# EAGLE design z80_SBC_micro (EAGLE 7.0.0)
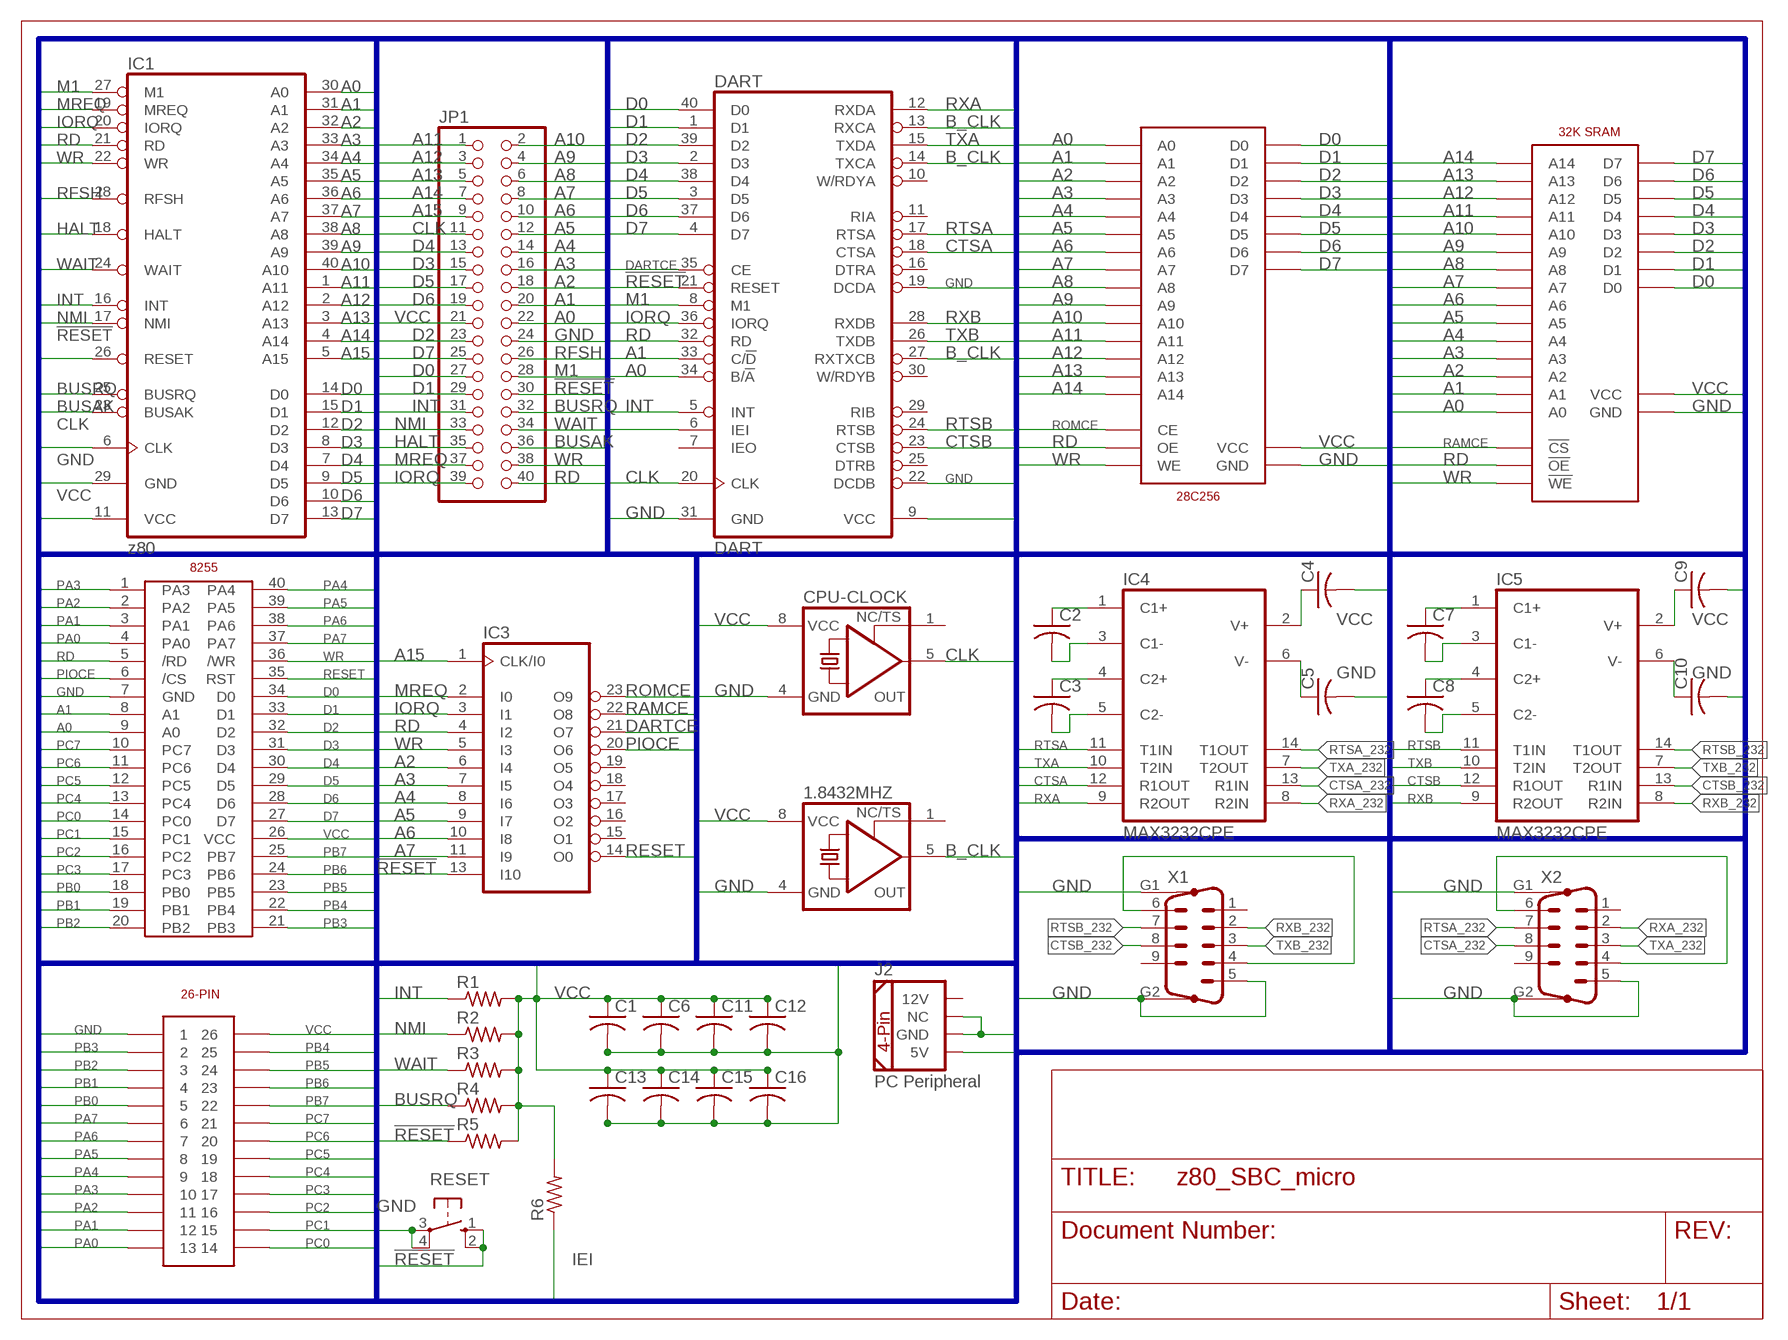
[diagram p0: schematic, sheet 1]

## Parts
1.8432MHZ  XO-8  [DIL08S]
28C256  28C256  [DIP28]
C1  C-USC0805  [C0805]
C2  C-USC0805  [C0805]
C3  C-USC0805  [C0805]
C4  C-USC0805  [C0805]
C5  C-USC0805  [C0805]
C6  C-USC0805  [C0805]
C7  C-USC0805  [C0805]
C8  C-USC0805  [C0805]
C9  C-USC0805  [C0805]
C10  C-USC0805  [C0805]
C11  C-USC0805  [C0805]
C12  C-USC0805  [C0805]
C13  C-USC0805  [C0805]
C14  C-USC0805  [C0805]
C15  C-USC0805  [C0805]
C16  C-USC0805  [C0805]
CPU-CLOCK  XO-8  [DIL08S]
DART  DART  Z80DART  [DIL40]
IC1  z80  Z80CPU  [DIL40]
IC3  22V10  [DIL24-3]
IC4  MAX3232CPE  [DIL16]
IC5  MAX3232CPE  [DIL16]
J1  SOCKET-DIP26  [SOCKET-DIP26]
J2  PC Peripheral  COMPUTER-PERIPHERAL-POWERVERTICAL  [COMPUTER-PERIPHERAL-POWER]
JP1  PINHD-2X20  [2X20]
R1  R-US_M0805  [M0805]
R2  R-US_M0805  [M0805]
R3  R-US_M0805  [M0805]
R4  R-US_M0805  [M0805]
R5  R-US_M0805  [M0805]
R6  R-US_M0805  [M0805]
RESET  10-XX  [B3F-10XX]
U1  32K SRAM  32K_SRAM_NARROW  [DIP28-300]
U$1  8255  [8255]
X1  M09HP  [M09HP]
X2  M09HP  [M09HP]

## Nets
!RESET: DART.21(RESET) IC1.26(RESET) IC3.13(I10) JP1.30 R5.1 RESET.1(S) RESET.2(S1)
A0: 28C256.P$10(A0) DART.34(B/!A) IC1.30(A0) JP1.22 U1.P$10(A0) U$1.9(A0)
A1: 28C256.P$9(A1) DART.33(C/!D) IC1.31(A1) JP1.20 U1.P$9(A1) U$1.8(A1)
A2: 28C256.P$8(A2) IC1.32(A2) IC3.6(I4) JP1.18 U1.P$8(A2)
A3: 28C256.P$7(A3) IC1.33(A3) IC3.7(I5) JP1.16 U1.P$7(A3)
A4: 28C256.P$6(A4) IC1.34(A4) IC3.8(I6) JP1.14 U1.P$6(A4)
A5: 28C256.P$5(A5) IC1.35(A5) IC3.9(I7) JP1.12 U1.P$5(A5)
A6: 28C256.P$4(A6) IC1.36(A6) IC3.10(I8) JP1.10 U1.P$4(A6)
A7: 28C256.P$3(A7) IC1.37(A7) IC3.11(I9) JP1.8 U1.P$3(A7)
A8: 28C256.P$25(A8) IC1.38(A8) JP1.6 U1.P$25(A8)
A9: 28C256.P$24(A9) IC1.39(A9) JP1.4 U1.P$24(A9)
A10: 28C256.P$21(A10) IC1.40(A10) JP1.2 U1.P$21(A10)
A11: 28C256.P$23(A11) IC1.1(A11) JP1.1 U1.P$23(A11)
A12: 28C256.P$2(A12) IC1.2(A12) JP1.3 U1.P$2(A12)
A13: 28C256.P$26(A13) IC1.3(A13) JP1.5 U1.P$26(A13)
A14: 28C256.P$1(A14) IC1.4(A14) JP1.7 U1.P$1(A14)
A15: IC1.5(A15) IC3.1(CLK/I0) JP1.9
B_CLK: 1.8432MHZ.5(OUT) DART.13(RXCA) DART.14(TXCA) DART.27(RXTXCB)
BUSAK: IC1.23(BUSAK) JP1.36
BUSRQ: IC1.25(BUSRQ) JP1.32 R4.1
CLK: CPU-CLOCK.5(OUT) DART.20(CLK) IC1.6(CLK) JP1.11
CTSA: DART.18(CTSA) IC4.12(R1OUT)
CTSA_232: IC4.13(R1IN) X2.8
CTSB: DART.23(CTSB) IC5.12(R1OUT)
CTSB_232: IC5.13(R1IN) X1.8
D0: 28C256.P$11(D0) DART.40(D0) IC1.14(D0) JP1.27 U1.P$11(D0) U$1.34(D0)
D1: 28C256.P$12(D1) DART.1(D1) IC1.15(D1) JP1.29 U1.P$12(D1) U$1.33(D1)
D2: 28C256.P$13(D2) DART.39(D2) IC1.12(D2) JP1.23 U1.P$13(D2) U$1.32(D2)
D3: 28C256.P$15(D3) DART.2(D3) IC1.8(D3) JP1.15 U1.P$15(D3) U$1.31(D3)
D4: 28C256.P$16(D4) DART.38(D4) IC1.7(D4) JP1.13 U1.P$16(D4) U$1.30(D4)
D5: 28C256.P$17(D5) DART.3(D5) IC1.9(D5) JP1.17 U1.P$17(D5) U$1.29(D5)
D6: 28C256.P$18(D6) DART.37(D6) IC1.10(D6) JP1.19 U1.P$18(D6) U$1.28(D6)
D7: 28C256.P$19(D7) DART.4(D7) IC1.13(D7) JP1.25 U1.P$19(D7) U$1.27(D7)
DARTCE: DART.35(CE) IC3.21(O7)
GND: 1.8432MHZ.4(GND) 28C256.P$14(GND) C1.2 C5.2 C6.2 C10.2 C11.2 C12.2 C13.2 C14.2 C15.2 C16.2 CPU-CLOCK.4(GND) DART.19(DCDA) DART.22(DCDB) DART.31(GND) IC1.29(GND) J1.P$1 J2.GND J2.NC JP1.24 RESET.3(P) RESET.4(P1) U1.P$14(GND) U$1.7(GND) X1.5 X1.G1 X1.G2 X2.5 X2.G1 X2.G2
HALT: IC1.18(HALT) JP1.35
IEI: DART.6(IEI) R6.1
INT: DART.5(INT) IC1.16(INT) JP1.31 R1.1
IORQ: DART.36(IORQ) IC1.20(IORQ) IC3.3(I1) JP1.39
M1: DART.8(M1) IC1.27(M1) JP1.28
MREQ: IC1.19(MREQ) IC3.2(I0) JP1.37
N$1: C7.1 IC5.1(C1+)
N$2: C8.1 IC5.4(C2+)
N$3: C8.2 IC5.5(C2-)
N$4: C7.2 IC5.3(C1-)
N$5: C9.1 IC5.2(V+)
N$6: C10.1 IC5.6(V-)
N$7: C2.1 IC4.1(C1+)
N$8: C3.1 IC4.4(C2+)
N$9: C2.2 IC4.3(C1-)
N$10: C3.2 IC4.5(C2-)
N$11: C4.1 IC4.2(V+)
N$12: C5.1 IC4.6(V-)
N$13: X1.4 X1.6
N$14: X2.4 X2.6
NMI: IC1.17(NMI) JP1.33 R2.1
PA0: J1.P$13 U$1.4(PA0)
PA1: J1.P$12 U$1.3(PA1)
PA2: J1.P$11 U$1.2(PA2)
PA3: J1.P$10 U$1.1(PA3)
PA4: J1.P$9 U$1.40(PA4)
PA5: J1.P$8 U$1.39(PA5)
PA6: J1.P$7 U$1.38(PA6)
PA7: J1.P$6 U$1.37(PA7)
PB0: J1.P$5 U$1.18(PB0)
PB1: J1.P$4 U$1.19(PB1)
PB2: J1.P$3 U$1.20(PB2)
PB3: J1.P$2 U$1.21(PB3)
PB4: J1.P$25 U$1.22(PB4)
PB5: J1.P$24 U$1.23(PB5)
PB6: J1.P$23 U$1.24(PB6)
PB7: J1.P$22 U$1.25(PB7)
PC0: J1.P$14 U$1.14(PC0)
PC1: J1.P$15 U$1.15(PC1)
PC2: J1.P$16 U$1.16(PC2)
PC3: J1.P$17 U$1.17(PC3)
PC4: J1.P$18 U$1.13(PC4)
PC5: J1.P$19 U$1.12(PC5)
PC6: J1.P$20 U$1.11(PC6)
PC7: J1.P$21 U$1.10(PC7)
PIOCE: IC3.20(O6) U$1.6(/CS)
RAMCE: IC3.22(O8) U1.P$20(!CS)
RD: 28C256.P$22(OE) DART.32(RD) IC1.21(RD) IC3.4(I2) JP1.40 U1.P$22(!OE) U$1.5(/RD)
RESET: IC3.14(O0) U$1.35(RST)
RFSH: IC1.28(RFSH) JP1.26
ROMCE: 28C256.P$20(CE) IC3.23(O9)
RTSA: DART.17(RTSA) IC4.11(T1IN)
RTSA_232: IC4.14(T1OUT) X2.7
RTSB: DART.24(RTSB) IC5.11(T1IN)
RTSB_232: IC5.14(T1OUT) X1.7
RXA: DART.12(RXDA) IC4.9(R2OUT)
RXA_232: IC4.8(R2IN) X2.2
RXB: DART.28(RXDB) IC5.9(R2OUT)
RXB_232: IC5.8(R2IN) X1.2
TXA: DART.15(TXDA) IC4.10(T2IN)
TXA_232: IC4.7(T2OUT) X2.3
TXB: DART.26(TXDB) IC5.10(T2IN)
TXB_232: IC5.7(T2OUT) X1.3
VCC: 1.8432MHZ.8(VCC) 28C256.P$28(VCC) C1.1 C4.2 C6.1 C9.2 C11.1 C12.1 C13.1 C14.1 C15.1 C16.1 CPU-CLOCK.8(VCC) DART.9(VCC) IC1.11(VCC) J1.P$26 J2.5V JP1.21 R1.2 R2.2 R3.2 R4.2 R5.2 R6.2 U1.P$28(VCC) U$1.26(VCC)
WAIT: IC1.24(WAIT) JP1.34 R3.1
WR: 28C256.P$27(WE) IC1.22(WR) IC3.5(I3) JP1.38 U1.P$27(!WE) U$1.36(/WR)
Unconnected: 1.8432MHZ.1(TS) CPU-CLOCK.1(TS) DART.7(IEO) DART.10(W/RDYA) DART.11(RIA) DART.16(DTRA) DART.25(DTRB) DART.29(RIB) DART.30(W/RDYB) IC3.15(O1) IC3.16(O2) IC3.17(O3) IC3.18(O4) IC3.19(O5) J2.12V X1.1 X1.9 X2.1 X2.9

## Buses
A[0..15],D[0..7],M1,MREQ,IORQ,RD,WR,RFSH,HALT,WAIT,INT,NMI,!RESET,RESET,BUSRQ,BUSAK,CLK,GND,VCC,RXA,TXA,RXB,TXB,RTSA,CTSA,RTSB,CTSB,B_CLK,PA[0..7],PB[0..7],PC[0..7],ROMCE,RAMCE,DARTCE,PIOCE,IEI

## Power pins joined to a net without a drawn wire
GND: IC3.12(GND) IC4.15(GND) IC5.15(GND)
VCC: IC3.24(VCC) IC4.16(VCC) IC5.16(VCC)

## Library data of the parts
1.8432MHZ CPU-CLOCK = crystal:XO-: CRYSTAL; OC_FARNELL: unknown; OC_NEWARK: unknown
28C256 = My_Parts:28C256
C1-C16 = resistor:C-US: CAPACITOR, American symbol
DART = zilog:Z80DART: Z80 FAMILY DEVICE
IC1 = zilog:Z80CPU: Z80 FAMILY DEVICE
IC3 = pal:22V10: PAL; MPN: GAL22V10D-7LPN; OC_FARNELL: 1571925; OC_NEWARK: 97M0480
IC4 IC5 = maxim:MAX3232*: True RS-232 Transceivers 3.0V to 5.5V, Low-Power up to 1Mbps, Using Four 0.1µF External Capacitors Source: http://pdfserv.maxim-ic.com/en/ds/MAX3222-MAX3241.pdf; MF: MAXIM; MPN: MAX3232CPE+; OC_FARNELL: 9724494; OC_NEWARK: 68K4626
J1 = My_Parts:SOCKET-DIP26
J2 = SparkFun-Connectors:COMPUTER-PERIPHERAL-POWER
JP1 = pinhead:PINHD-2X20: PIN HEADER
R1-R6 = resistor:R-US_: RESISTOR, American symbol
RESET = switch-omron:10-XX: OMRON SWITCH
U1 = My_Parts_old+:32K_SRAM_NARROW
U$1 = My_Parts_old+:8255
X1 X2 = con-subd:M09HP: SUB-D; OC_FARNELL: unknown; OC_NEWARK: unknown

## Board
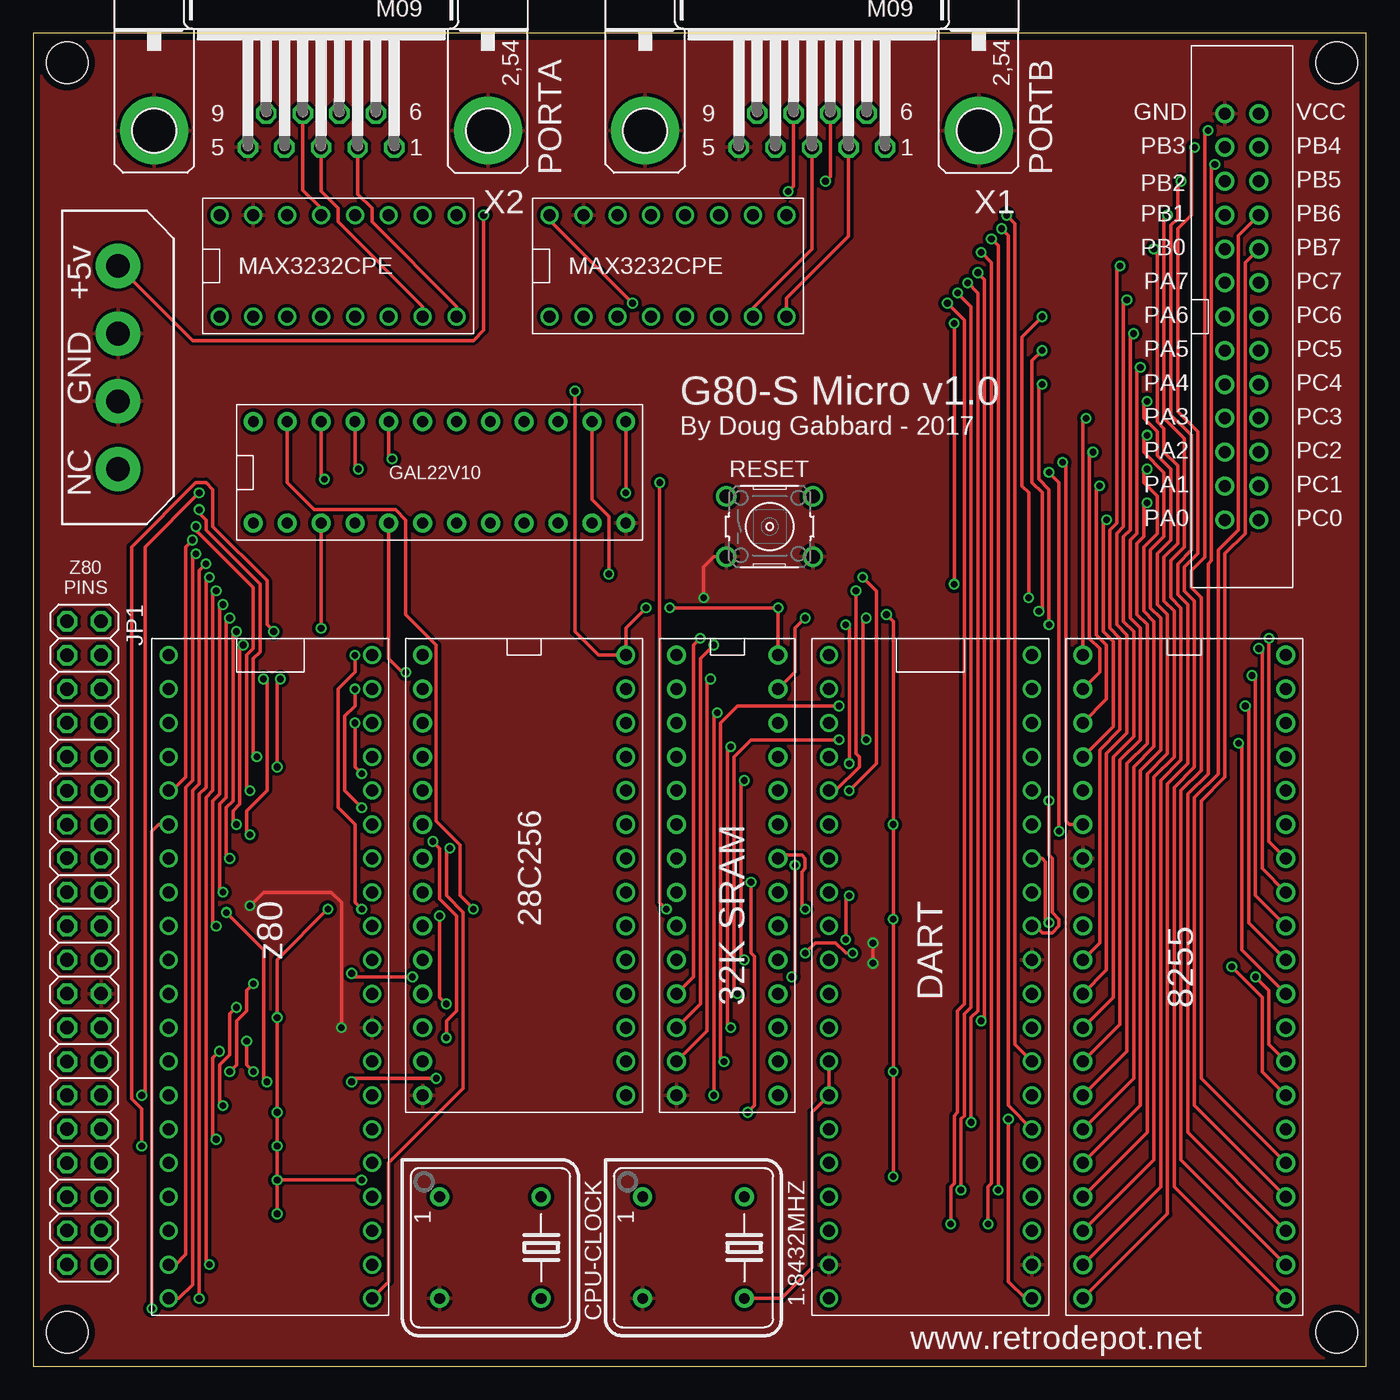
[diagram p1: board, top side]
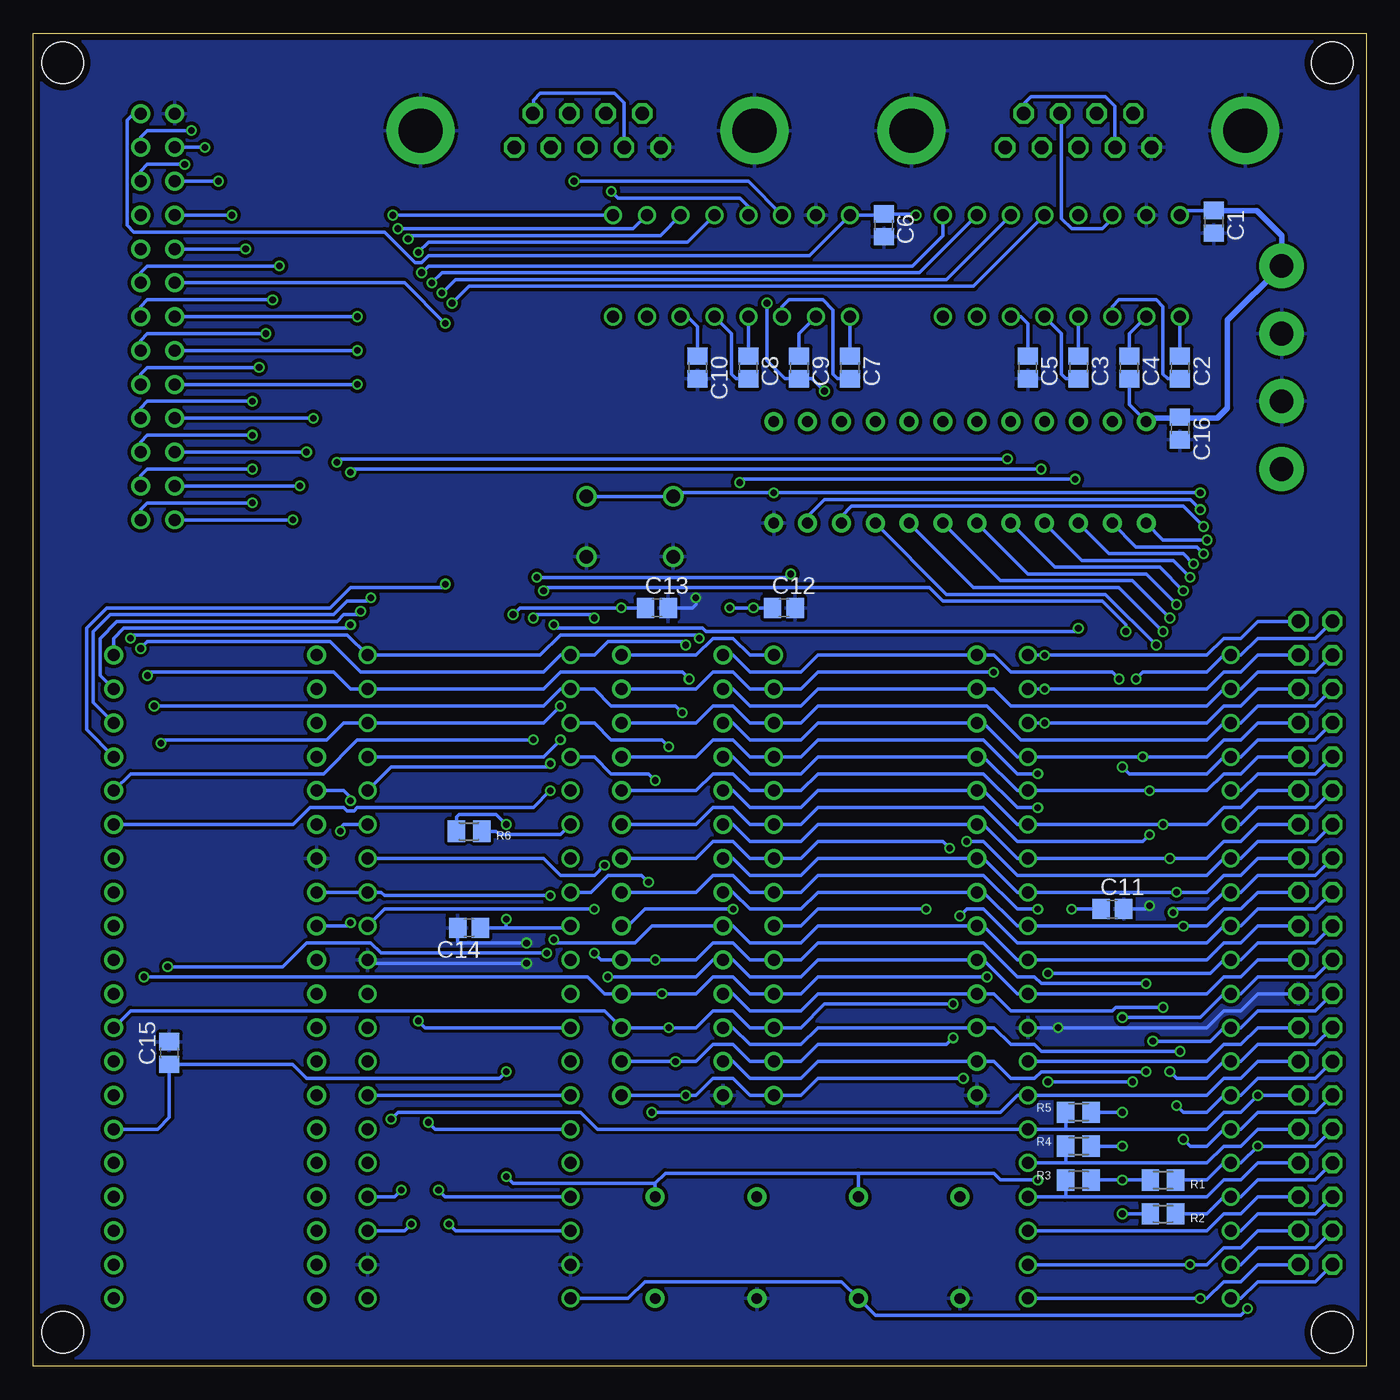
[diagram p2: board, bottom side, seen from below]

Size 100 x 100 mm. Coordinates in mm from the lower left corner, seen from the top.
Outline: 0,0 100,0 100,100 0,100 0,0
Copper layers (1*16): Top 0.035mm / dielectric 1.6mm / Bottom 0.035mm
Design rules "Elecrow_2-layer_PCB_eagle_rule": minimum track width 6mil, minimum drill 12mil, track to track 6mil, track to pad 6mil, pad to pad 6mil, via to via 8mil, smd to smd 0mil, copper to edge 20mil, drill to drill 10mil, minimum pad ring 6mil, minimum via ring 6mil, stop-mask expansion 0mil, vias tented up to drill 100mil, thermal gap 10mil
Holes 3.1 mm at 97.79,2.54 2.54,2.54 97.79,97.79 2.54,97.79

### Footprints (pad centres in the part's own frame; a part is rotated, then mirrored left to right if it is on the bottom)
DIL08S = drill 0.813 pad 1.422: 1 -3.81,-3.81; 4 3.81,-3.81; 5 3.81,3.81; 8 -3.81,3.81
DIP28 = drill 0.9 pad 1.422: P$1 -7.62,16.51; P$2 -7.62,13.97; P$3 -7.62,11.43; P$4 -7.62,8.89; P$5 -7.62,6.35; P$6 -7.62,3.81; P$7 -7.62,1.27; P$8 -7.62,-1.27; P$9 -7.62,-3.81; P$10 -7.62,-6.35; P$11 -7.62,-8.89; P$12 -7.62,-11.43; P$13 -7.62,-13.97; P$14 -7.62,-16.51; P$15 7.62,-16.51; P$16 7.62,-13.97; P$17 7.62,-11.43; P$18 7.62,-8.89; P$19 7.62,-6.35; P$20 7.62,-3.81; P$21 7.62,-1.27; P$22 7.62,1.27; P$23 7.62,3.81; P$24 7.62,6.35; P$25 7.62,8.89; P$26 7.62,11.43; P$27 7.62,13.97; P$28 7.62,16.51
C0805 = smd 1.3 x 1.5: 1 -0.85,0; 2 0.85,0
DIL40 = drill 0.9: 1 -24.13,-7.62; 2 -21.59,-7.62; 3 -19.05,-7.62; 4 -16.51,-7.62; 5 -13.97,-7.62; 6 -11.43,-7.62; 7 -8.89,-7.62; 8 -6.35,-7.62; 9 -3.81,-7.62; 10 -1.27,-7.62; 11 1.27,-7.62; 12 3.81,-7.62; 13 6.35,-7.62; 14 8.89,-7.62; 15 11.43,-7.62; 16 13.97,-7.62; 17 16.51,-7.62; 18 19.05,-7.62; 19 21.59,-7.62; 20 24.13,-7.62; 21 24.13,7.62; 22 21.59,7.62; 23 19.05,7.62; 24 16.51,7.62; 25 13.97,7.62; 26 11.43,7.62; 27 8.89,7.62; 28 6.35,7.62; 29 3.81,7.62; 30 1.27,7.62; 31 -1.27,7.62; 32 -3.81,7.62; 33 -6.35,7.62; 34 -8.89,7.62; 35 -11.43,7.62; 36 -13.97,7.62; 37 -16.51,7.62; 38 -19.05,7.62; 39 -21.59,7.62; 40 -24.13,7.62
DIL24-3 = drill 0.813 pad 1.422: 1 -13.97,-3.81; 2 -11.43,-3.81; 3 -8.89,-3.81; 4 -6.35,-3.81; 5 -3.81,-3.81; 6 -1.27,-3.81; 7 1.27,-3.81; 8 3.81,-3.81; 9 6.35,-3.81; 10 8.89,-3.81; 11 11.43,-3.81; 12 13.97,-3.81; 13 13.97,3.81; 14 11.43,3.81; 15 8.89,3.81; 16 6.35,3.81; 17 3.81,3.81; 18 1.27,3.81; 19 -1.27,3.81; 20 -3.81,3.81; 21 -6.35,3.81; 22 -8.89,3.81; 23 -11.43,3.81; 24 -13.97,3.81
DIL16 = drill 0.9: 1 -8.89,-3.81; 2 -6.35,-3.81; 3 -3.81,-3.81; 4 -1.27,-3.81; 5 1.27,-3.81; 6 3.81,-3.81; 7 6.35,-3.81; 8 8.89,-3.81; 9 8.89,3.81; 10 6.35,3.81; 11 3.81,3.81; 12 1.27,3.81; 13 -1.27,3.81; 14 -3.81,3.81; 15 -6.35,3.81; 16 -8.89,3.81
SOCKET-DIP26 = drill 0.9 pad 1.422: P$1 -1.27,15.24; P$2 -1.27,12.7; P$3 -1.27,10.16; P$4 -1.27,7.62; P$5 -1.27,5.08; P$6 -1.27,2.54; P$7 -1.27,0; P$8 -1.27,-2.54; P$9 -1.27,-5.08; P$10 -1.27,-7.62; P$11 -1.27,-10.16; P$12 -1.27,-12.7; P$13 -1.27,-15.24; P$14 1.27,-15.24; P$15 1.27,-12.7; P$16 1.27,-10.16; P$17 1.27,-7.62; P$18 1.27,-5.08; P$19 1.27,-2.54; P$20 1.27,0; P$21 1.27,2.54; P$22 1.27,5.08; P$23 1.27,7.62; P$24 1.27,10.16; P$25 1.27,12.7; P$26 1.27,15.24
COMPUTER-PERIPHERAL-POWER = drill 1.778 pad 3.302: 5V 7.62,0; 12V -7.62,0; GND 2.54,0; NC -2.54,0
2X20 = drill 1.016 octagon: 1 -24.13,-1.27; 2 -24.13,1.27; 3 -21.59,-1.27; 4 -21.59,1.27; 5 -19.05,-1.27; 6 -19.05,1.27; 7 -16.51,-1.27; 8 -16.51,1.27; 9 -13.97,-1.27; 10 -13.97,1.27; 11 -11.43,-1.27; 12 -11.43,1.27; 13 -8.89,-1.27; 14 -8.89,1.27; 15 -6.35,-1.27; 16 -6.35,1.27; 17 -3.81,-1.27; 18 -3.81,1.27; 19 -1.27,-1.27; 20 -1.27,1.27; 21 1.27,-1.27; 22 1.27,1.27; 23 3.81,-1.27; 24 3.81,1.27; 25 6.35,-1.27; 26 6.35,1.27; 27 8.89,-1.27; 28 8.89,1.27; 29 11.43,-1.27; 30 11.43,1.27; 31 13.97,-1.27; 32 13.97,1.27; 33 16.51,-1.27; 34 16.51,1.27; 35 19.05,-1.27; 36 19.05,1.27; 37 21.59,-1.27; 38 21.59,1.27; 39 24.13,-1.27; 40 24.13,1.27
M0805 = smd 1.3 x 1.6: 1 -0.95,0; 2 0.95,0
B3F-10XX = drill 1.016: 1 -3.251,2.261; 2 3.251,2.261; 3 -3.251,-2.261; 4 3.251,-2.261
DIP28-300 = drill 0.9 pad 1.422: P$1 -3.81,16.51; P$2 -3.81,13.97; P$3 -3.81,11.43; P$4 -3.81,8.89; P$5 -3.81,6.35; P$6 -3.81,3.81; P$7 -3.81,1.27; P$8 -3.81,-1.27; P$9 -3.81,-3.81; P$10 -3.81,-6.35; P$11 -3.81,-8.89; P$12 -3.81,-11.43; P$13 -3.81,-13.97; P$14 -3.81,-16.51; P$15 3.81,-16.51; P$16 3.81,-13.97; P$17 3.81,-11.43; P$18 3.81,-8.89; P$19 3.81,-6.35; P$20 3.81,-3.81; P$21 3.81,-1.27; P$22 3.81,1.27; P$23 3.81,3.81; P$24 3.81,6.35; P$25 3.81,8.89; P$26 3.81,11.43; P$27 3.81,13.97; P$28 3.81,16.51
8255 = drill 0.9 pad 1.422: 1 -7.62,22.86; 2 -7.62,20.32; 3 -7.62,17.78; 4 -7.62,15.24; 5 -7.62,12.7; 6 -7.62,10.16; 7 -7.62,7.62; 8 -7.62,5.08; 9 -7.62,2.54; 10 -7.62,0; 11 -7.62,-2.54; 12 -7.62,-5.08; 13 -7.62,-7.62; 14 -7.62,-10.16; 15 -7.62,-12.7; 16 -7.62,-15.24; 17 -7.62,-17.78; 18 -7.62,-20.32; 19 -7.62,-22.86; 20 -7.62,-25.4; 21 7.62,-25.4; 22 7.62,-22.86; 23 7.62,-20.32; 24 7.62,-17.78; 25 7.62,-15.24; 26 7.62,-12.7; 27 7.62,-10.16; 28 7.62,-7.62; 29 7.62,-5.08; 30 7.62,-2.54; 31 7.62,0; 32 7.62,2.54; 33 7.62,5.08; 34 7.62,7.62; 35 7.62,10.16; 36 7.62,12.7; 37 7.62,15.24; 38 7.62,17.78; 39 7.62,20.32; 40 7.62,22.86
M09HP = drill 1.016 octagon: 1 -5.486,1.27; 2 -2.743,1.27; 3 0,1.27; 4 2.743,1.27; 5 5.486,1.27; 6 -4.115,-1.27; 7 -1.372,-1.27; 8 1.372,-1.27; 9 4.115,-1.27 | drill 3.302 pad 5.08: G1 -12.522,0; G2 12.522,0

### Placement (x,y rotation side)
1.8432MHZ  49.53,8.89 270 top
28C256  36.83,36.83 0 top
C1  11.43,85.85 270 bottom
C2  13.97,74.93 270 bottom
C3  21.59,74.93 270 bottom
C4  17.78,74.93 270 bottom
C5  25.4,74.93 270 bottom
C6  36.2,85.6 270 bottom
C7  38.73,74.93 270 bottom
C8  46.35,74.93 270 bottom
C9  42.55,74.93 270 bottom
C10  50.16,74.93 270 bottom
C11  19.05,34.29 0 bottom
C12  43.69,56.9 0 bottom
C13  53.21,56.9 0 bottom
C14  67.31,32.89 180 bottom
C15  89.79,23.5 90 bottom
C16  13.97,70.36 270 bottom
CPU-CLOCK  34.29,8.89 270 top
DART  67.31,29.21 270 top
IC1  17.78,29.21 270 top
IC3  30.48,67.06 0 top
IC4  22.86,82.55 0 top
IC5  47.62,82.55 0 top
J1  90.68,78.74 0 top
J2  6.35,74.93 90 top
JP1  3.81,31.75 270 top
R1  15.24,13.97 180 bottom
R2  15.24,11.43 180 bottom
R3  21.59,13.97 0 bottom
R4  21.59,16.51 0 bottom
R5  21.59,19.05 0 bottom
R6  67.31,40.13 180 bottom
RESET  55.24,62.99 0 top
U1  52.07,36.83 0 top
U$1  86.36,30.48 0 top
X1  58.42,92.71 180 top
X2  21.59,92.71 180 top

### Tracks (layer width: path | path; a pad name or v marks a point on that pad's centre or on a via)
!RESET  (via drill 0.5)
  Top 0.254: v8.13,20.32 8.38,20.57 8.38,61.47 v12.45,65.53 | IC3.13 v44.45,65.53 | v73.15,18.54 73.15,6.35 74.42,5.08 DART.21
  Bottom 0.254: JP1.30 v8.13,20.32 9.4,19.05 10.67,19.05 11.94,17.78 22.61,17.78 | R5.1 22.54,17.85 22.61,17.78 | 22.61,17.78 IC1.26 57.66,17.78 58.93,19.05 72.64,19.05 v73.15,18.54 | v12.45,65.53 v44.45,65.53 51.71,65.53 RESET.1 RESET.2
A0  (via drill 0.5)
  Top 0.254: v57.15,37.59 57.15,29.46 v56.9,29.21 | DART.34 75.69,38.1 75.95,37.85 75.95,33.53 v76.2,33.27
  Bottom 0.254: JP1.22 8.13,30.48 9.4,29.21 10.67,29.21 11.94,27.94 IC1.30 26.16,27.94 28.7,30.48 28C256.P$10 41.15,30.48 42.42,29.21 46.23,29.21 47.5,30.48 U1.P$10 49.02,30.48 50.29,29.21 v56.9,29.21 | DART.34 61.72,38.1 60.45,36.83 57.91,36.83 v57.15,37.59 | v76.2,33.27 76.45,33.02 U$1.9
A1  (via drill 0.5)
  Top 0.254: v60.96,32 60.96,35.05 v61.21,35.31
  Bottom 0.254: JP1.20 8.13,33.02 9.4,31.75 10.67,31.75 11.94,30.48 IC1.31 26.16,30.48 28.7,33.02 28C256.P$9 41.15,33.02 42.42,31.75 46.23,31.75 47.5,33.02 U1.P$9 53.59,33.02 54.86,31.75 60.71,31.75 v60.96,32 | v61.21,35.31 73.66,35.31 73.91,35.56 DART.33 U$1.8
A2  (via drill 0.5)
  Top 0.254: v14.22,57.15 13.97,56.9 13.97,42.93 13.46,42.42 13.46,33.27 v13.72,33.02
  Bottom 0.254: JP1.18 8.13,35.56 9.4,34.29 10.67,34.29 11.94,33.02 13.46,33.02 v13.72,33.02 IC1.32 26.16,33.02 28.7,35.56 28C256.P$8 41.15,35.56 42.42,34.29 46.23,34.29 47.5,35.56 U1.P$8 | IC3.6 25.4,59.44 16.51,59.44 v14.22,57.15
A3  (via drill 0.5)
  Top 0.254: v14.73,56.13 14.48,55.88 14.48,42.67 13.97,42.16 13.97,35.81 v14.22,35.56
  Bottom 0.254: JP1.16 8.13,38.1 9.4,36.83 10.67,36.83 11.94,35.56 13.97,35.56 v14.22,35.56 IC1.33 26.16,35.56 28.7,38.1 28C256.P$7 41.15,38.1 42.42,36.83 46.23,36.83 47.5,38.1 U1.P$7 | IC3.7 27.43,58.93 17.53,58.93 v14.73,56.13
A4  (via drill 0.5)
  Top 0.254: v15.24,55.12 14.99,54.86 14.99,42.42 14.48,41.91 14.48,38.35 v14.73,38.1
  Bottom 0.254: JP1.14 8.13,40.64 9.4,39.37 10.67,39.37 11.94,38.1 14.48,38.1 v14.73,38.1 IC1.34 26.16,38.1 28.7,40.64 28C256.P$6 41.15,40.64 42.42,39.37 46.23,39.37 47.5,40.64 U1.P$6 | IC3.8 29.46,58.42 18.54,58.42 v15.24,55.12
A5  (via drill 0.5)
  Top 0.254: v15.75,54.1 15.49,53.85 15.49,42.16 14.99,41.66 14.99,40.89 v15.24,40.64
  Bottom 0.254: JP1.12 8.13,43.18 9.4,41.91 10.67,41.91 11.94,40.64 14.99,40.64 v15.24,40.64 IC1.35 26.16,40.64 28.7,43.18 28C256.P$5 41.15,43.18 42.42,41.91 46.23,41.91 47.5,43.18 U1.P$5 | IC3.9 31.5,57.91 19.56,57.91 v15.75,54.1
A6  (via drill 0.5)
  Top 0.254: v12.19,62.99 12.19,62.74 16.51,58.42 16.51,53.85 16,53.34 16,43.43 v16.26,43.18
  Bottom 0.254: JP1.10 8.13,45.72 9.4,44.45 10.67,44.45 11.94,43.18 16,43.18 v16.26,43.18 IC1.36 26.16,43.18 28.7,45.72 28C256.P$4 41.15,45.72 42.42,44.45 46.23,44.45 47.5,45.72 U1.P$4 | IC3.10 39.37,63.75 38.61,64.52 13.72,64.52 v12.19,62.99
A7  (via drill 0.5)
  Top 0.254: v12.45,64.26 12.45,64.01 12.95,63.5 12.95,62.74 17.02,58.67 17.02,53.59 16.51,53.09 16.51,45.97 v16.76,45.72
  Bottom 0.254: JP1.8 8.13,48.26 9.4,46.99 10.67,46.99 11.94,45.72 16.51,45.72 v16.76,45.72 IC1.37 26.16,45.72 28.7,48.26 28C256.P$3 41.15,48.26 42.42,46.99 46.23,46.99 47.5,48.26 U1.P$3 | IC3.11 41.91,63.75 40.64,65.02 13.21,65.02 v12.45,64.26
A8  (via drill 0.5)
  Top 0.254: v24.13,48.26 24.13,44.96 v24.64,44.45
  Bottom 0.254: JP1.6 8.13,50.8 9.4,49.53 10.67,49.53 11.94,48.26 v24.13,48.26 IC1.38 | U1.P$25 50.29,45.72 49.02,46.99 47.5,46.99 46.23,45.72 28C256.P$25 42.42,45.72 41.15,46.99 28.7,46.99 26.16,44.45 v24.64,44.45
A9  (via drill 0.5)
  Top 0.254: v24.13,50.8 24.13,49.53 23.37,48.77 23.37,43.18 v24.64,41.91
  Bottom 0.254: JP1.4 8.13,53.34 9.4,52.07 10.67,52.07 11.94,50.8 v24.13,50.8 IC1.39 | U1.P$24 50.29,43.18 49.02,44.45 47.5,44.45 46.23,43.18 28C256.P$24 42.42,43.18 41.15,44.45 28.7,44.45 26.16,41.91 v24.64,41.91
A10  (via drill 0.5)
  Top 0.254: v24.13,53.34 24.13,52.07 22.86,50.8 22.86,41.91 24.13,40.64 24.13,34.8 v24.64,34.29
  Bottom 0.254: JP1.2 8.13,55.88 9.4,54.61 10.67,54.61 11.94,53.34 v24.13,53.34 IC1.40 | U1.P$21 50.29,35.56 49.02,36.83 47.5,36.83 46.23,35.56 28C256.P$21 42.42,35.56 41.15,36.83 28.7,36.83 26.16,34.29 v24.64,34.29
A11  (via drill 0.5)
  Top 0.254: v17.27,51.56 17.53,51.31 17.53,43.18 16,41.66 16,40.13 v16.26,39.88
  Bottom 0.254: JP1.1 3.81,54.61 8.13,54.61 9.4,53.34 IC1.1 10.67,53.34 11.94,52.07 16.76,52.07 v17.27,51.56 | U1.P$23 50.29,40.64 49.02,41.91 47.5,41.91 46.23,40.64 28C256.P$23 42.42,40.64 41.15,41.91 28.7,41.91 26.16,39.37 16.76,39.37 v16.26,39.88
A12
  Bottom 0.254: JP1.3 3.81,52.07 8.13,52.07 9.4,50.8 IC1.2 10.67,50.8 11.94,49.53 26.67,49.53 27.94,50.8 28C256.P$2 41.15,50.8 42.42,49.53 46.23,49.53 47.5,50.8 U1.P$2
A13
  Bottom 0.254: JP1.5 3.81,49.53 8.13,49.53 9.4,48.26 IC1.3 10.67,48.26 11.94,46.99 25.91,46.99 28.45,49.53 41.15,49.53 42.42,48.26 28C256.P$26 46.23,48.26 47.5,49.53 49.02,49.53 50.29,48.26 U1.P$26
A14  (via drill 0.5)
  Top 0.254: v18.29,44.96 18.29,51.31 v18.54,51.56
  Bottom 0.254: JP1.7 3.81,46.99 8.13,46.99 9.4,45.72 IC1.4 10.67,45.72 11.94,44.45 17.78,44.45 v18.29,44.96 | U1.P$1 47.5,53.34 46.23,52.07 42.42,52.07 41.15,53.34 28C256.P$1 27.94,53.34 26.67,52.07 19.05,52.07 v18.54,51.56
A15  (via drill 0.5)
  Top 0.254: IC1.5 10.41,43.18 11.43,44.2 11.43,61.47 v11.94,61.98
  Bottom 0.254: JP1.9 3.81,44.45 8.13,44.45 9.4,43.18 IC1.5 | v11.94,61.98 15.24,61.98 IC3.1
B_CLK
  Top 0.254: DART.13 DART.14 58.42,19.05 58.42,7.37 56.13,5.08 1.8432MHZ.5
  Bottom 0.254: DART.27 DART.14
BUSAK
  Bottom 0.254: JP1.36 8.13,12.7 9.4,11.43 10.67,11.43 11.94,10.16 IC1.23
BUSRQ
  Bottom 0.254: JP1.32 8.13,17.78 9.4,16.51 10.67,16.51 11.94,15.24 22.61,15.24 | 22.61,15.24 IC1.25 | R4.1 22.54,15.31 22.61,15.24
CLK  (via drill 0.5)
  Top 0.254: v8.89,4.32 8.89,40.13 9.4,40.64 IC1.6
  Bottom 0.254: JP1.11 3.81,41.91 8.13,41.91 9.4,40.64 IC1.6 | v8.89,4.32 9.4,3.81 36.83,3.81 CPU-CLOCK.5 39.37,6.35 54.1,6.35 55.37,5.08 DART.20
CTSA  (via drill 0.5)
  Top 0.254: v68.83,10.67 68.83,13.46 69.09,13.72 69.09,18.8 69.34,19.05 69.34,26.67 69.85,27.18 69.85,78.49 v68.58,79.76
  Bottom 0.254: DART.18 68.33,10.16 v68.83,10.67 | v68.58,79.76 67.31,81.03 29.46,81.03 IC4.12
CTSA_232
  Top 0.254: X2.8 20.22,88.24 21.59,86.87 IC4.13
CTSB  (via drill 0.5)
  Top 0.254: v71.63,10.67 71.63,13.46 71.88,13.72 71.88,82.8 v71.12,83.57
  Bottom 0.254: DART.23 72.14,10.16 v71.63,10.67 | v71.12,83.57 70.36,84.33 50.93,84.33 IC5.12
CTSB_232  (via drill 0.5)
  Top 0.254: 56.9,88.39 v56.64,88.14 57.05,88.54 X1.8
  Bottom 0.254: IC5.13 46.35,87 46.99,87.63 56.13,87.63 v56.64,88.14
D0  (via drill 0.5)
  Top 0.254: v14.22,19.56 13.97,19.81 13.97,22.61 14.73,23.37 14.73,26.42 v15.24,26.92 | v50.04,54.61 49.53,54.1 49.53,29.21 U1.P$11 | v92.71,54.61 92.71,39.37 U$1.34
  Bottom 0.254: JP1.27 3.81,21.59 8.13,21.59 9.4,20.32 IC1.14 10.67,20.32 11.94,19.05 13.72,19.05 v14.22,19.56 | U1.P$11 47.5,27.94 46.23,26.67 42.42,26.67 41.15,27.94 28C256.P$11 27.94,27.94 26.67,26.67 19.05,26.67 18.8,26.92 v15.24,26.92 | v50.04,54.61 50.29,54.86 60.45,54.86 61.98,53.34 DART.40 76.45,54.86 92.46,54.86 v92.71,54.61
D1  (via drill 0.5)
  Top 0.254: v13.72,17.02 13.46,17.27 13.46,23.11 v13.97,23.62 | v51.05,54.1 50.04,53.09 50.04,27.18 U1.P$12 | U$1.33 92.2,37.34 92.2,53.59 v91.95,53.85
  Bottom 0.254: JP1.29 3.81,19.05 8.13,19.05 9.4,17.78 IC1.15 10.67,17.78 11.94,16.51 13.21,16.51 v13.72,17.02 | U1.P$12 47.5,25.4 46.23,24.13 42.42,24.13 41.15,25.4 28C256.P$12 27.94,25.4 26.67,24.13 24.89,24.13 24.38,23.62 v13.97,23.62 | v51.05,54.1 51.31,54.36 56.9,54.36 57.91,53.34 DART.1 60.45,53.34 61.72,52.07 75.44,52.07 77.72,54.36 91.44,54.36 v91.95,53.85
D2  (via drill 0.5)
  Top 0.254: v16,24.38 16,22.61 v16.51,22.1 | v50.8,51.56 50.55,51.31 50.55,25.15 U1.P$13 | v91.44,51.82 91.69,51.56 91.69,35.31 U$1.32
  Bottom 0.254: JP1.23 3.81,26.67 8.13,26.67 9.4,25.4 IC1.12 10.67,25.4 11.68,24.38 v16,24.38 | U1.P$13 47.5,22.86 46.23,21.59 42.42,21.59 41.15,22.86 28C256.P$13 27.94,22.86 26.67,21.59 24.89,21.59 24.38,22.1 v16.51,22.1 | v50.8,51.56 51.31,52.07 60.45,52.07 61.72,50.8 DART.39 76.2,50.8 77.47,52.07 91.19,52.07 v91.44,51.82
D3  (via drill 0.5)
  Top 0.254: v14.48,34.04 17.27,31.24 17.27,21.59 v17.53,21.34 | v23.88,21.34 24.13,21.59 v30.23,21.59 | v51.31,49.02 51.05,48.77 v51.05,20.32 | U$1.31 91.19,33.27 91.19,49.28 v90.93,49.53
  Bottom 0.254: JP1.15 3.81,36.83 8.13,36.83 9.4,35.56 IC1.8 10.67,35.56 11.94,34.29 14.22,34.29 v14.48,34.04 | U1.P$15 v51.05,20.32 50.29,20.32 49.02,21.59 47.5,21.59 46.23,20.32 28C256.P$15 42.42,20.32 41.15,21.59 v30.23,21.59 | v17.53,21.34 v23.88,21.34 | v51.31,49.02 51.82,49.53 56.64,49.53 57.91,50.8 DART.2 60.45,50.8 61.72,49.53 v90.93,49.53
D4  (via drill 0.5)
  Top 0.254: v30.99,24.64 30.99,25.91 31.75,26.67 31.75,33.78 30.48,35.05 30.48,38.86 v29.97,39.37 | v60.45,49.53 52.83,49.53 51.56,48.26 51.56,23.11 v51.82,22.86 | v90.42,46.74 90.68,46.48 90.68,31.24 U$1.30
  Bottom 0.254: JP1.13 3.81,39.37 8.13,39.37 9.4,38.1 IC1.7 10.67,38.1 11.94,36.83 26.16,36.83 28.7,39.37 v29.97,39.37 | U1.P$16 v51.82,22.86 50.29,22.86 49.02,24.13 47.5,24.13 46.23,22.86 28C256.P$16 42.42,22.86 41.15,24.13 31.5,24.13 v30.99,24.64 | v60.45,49.53 61.72,48.26 DART.38 76.71,48.26 77.98,46.99 90.17,46.99 v90.42,46.74
D5  (via drill 0.5)
  Top 0.254: v30.48,33.78 30.48,27.69 v30.99,27.18 | v52.32,46.48 52.07,46.23 52.07,25.65 v52.32,25.4
  Bottom 0.254: JP1.17 3.81,34.29 8.13,34.29 9.4,33.02 IC1.9 10.67,33.02 11.94,31.75 26.16,31.75 28.7,34.29 29.97,34.29 v30.48,33.78 | v30.99,27.18 40.64,27.18 42.42,25.4 28C256.P$17 46.23,25.4 47.5,26.67 49.02,26.67 50.29,25.4 v52.32,25.4 U1.P$17 57.15,26.67 92.71,26.67 U$1.29 | DART.3 57.91,48.26 56.64,46.99 52.83,46.99 v52.32,46.48
D6  (via drill 0.5)
  Top 0.254: v23.88,29.46 24.13,29.21 v28.45,29.21 | v60.45,46.99 53.85,46.99 52.58,45.72 52.58,28.19 v52.83,27.94 | U$1.28 92.71,24.13 92.71,28.19 v91.69,29.21
  Bottom 0.254: JP1.19 3.81,31.75 8.13,31.75 9.4,30.48 IC1.10 10.67,30.48 11.68,29.46 v23.88,29.46 | v28.45,29.21 41.15,29.21 42.42,27.94 28C256.P$18 46.23,27.94 47.5,29.21 49.02,29.21 50.29,27.94 v52.83,27.94 U1.P$18 57.15,27.94 58.42,29.21 v91.69,29.21 | DART.37 61.72,45.72 v60.45,46.99
D7  (via drill 0.5)
  Top 0.254: v14.73,22.1 15.24,22.61 15.24,25.91 16,26.67 16,28.19 v16.51,28.7 | v53.34,43.94 53.09,43.69 53.09,30.73 v53.34,30.48 | U$1.27 92.2,22.1 92.2,27.69 v89.92,29.97 | v61.47,30.99 60.96,30.99 60.2,31.75 58.67,31.75 v57.91,30.99
  Bottom 0.254: JP1.25 3.81,24.13 8.13,24.13 9.4,22.86 IC1.13 10.67,22.86 11.94,21.59 14.22,21.59 v14.73,22.1 | v16.51,28.7 24.38,28.7 24.89,29.21 26.16,29.21 28.7,31.75 41.15,31.75 42.42,30.48 28C256.P$19 46.23,30.48 47.5,31.75 49.02,31.75 50.29,30.48 v53.34,30.48 U1.P$19 57.4,30.48 v57.91,30.99 | DART.4 57.91,45.72 56.64,44.45 53.85,44.45 v53.34,43.94 | v89.92,29.97 81.28,29.97 79.5,31.75 74.68,31.75 73.91,30.99 v61.47,30.99
DARTCE  (via drill 0.5)
  Top 0.254: IC3.21 24.13,67.56 v24.38,67.31 | v76.2,67.06 76.96,66.29 v76.96,40.13
  Bottom 0.254: v24.38,67.31 75.95,67.31 v76.2,67.06 | v76.96,40.13 76.96,40.39 76.71,40.64 DART.35
GND  (via drill 0.5)
  Top 0.254: v62.99,31.75 v62.99,30.23 | v16.26,34.54 17.27,35.56 22.35,35.56 23.11,34.8 v23.11,25.4 | RESET.3 51.08,60.73 50.29,59.94 v50.29,57.66
  Bottom 0.254: JP1.24 8.13,27.94 9.4,26.67 10.67,26.67 11.94,25.4 v23.11,25.4 IC1.29 | C14.2 68.16,31.84 68.07,31.75 v62.99,31.75 | v62.99,30.23 74.68,30.23 DART.31 | C11.2 16.51,34.29 v16.26,34.54 | v50.29,57.66 50.29,57.15 50.55,56.9 C13.2
  pour Bottom (isolate 0.254): 0.25,99.82 99.82,99.82 99.82,0.25 0.25,0.25
  pour Top (isolate 0.254): 0.25,99.82 99.82,99.82 99.82,0.25 0.25,0.25
HALT
  Bottom 0.254: JP1.35 3.81,11.43 8.13,11.43 9.4,10.16 IC1.18
IEI
  Bottom 0.254: DART.6 60.45,39.88 65.02,39.88 65.28,40.13 R6.1
INT  (via drill 0.5)
  Top 0.254: v8.13,16.51 8.13,19.3 7.37,20.07 7.37,61.47 12.19,66.29 12.95,66.29 13.46,65.79 13.46,62.99 17.53,58.93 17.53,55.63 v18.03,55.12 | v61.72,58.17 61.72,45.97 61.98,45.72 61.98,44.96 60.2,43.18 DART.5
  Bottom 0.254: JP1.31 3.81,16.51 v8.13,16.51 9.4,15.24 IC1.16 10.67,15.24 11.94,13.97 R1.1 | v18.03,55.12 18.03,55.63 19.81,57.4 31.75,57.4 32.77,58.42 61.47,58.42 v61.72,58.17
IORQ  (via drill 0.5)
  Top 0.254: v12.95,60.2 12.45,59.69 12.45,43.69 11.94,43.18 11.94,6.1 10.92,5.08 IC1.20 | v61.21,45.21 61.21,55.37 v60.96,55.63 | v21.59,55.37 IC3.3
  Bottom 0.254: JP1.39 3.81,6.35 8.13,6.35 9.4,5.08 IC1.20 | IC3.3 19.3,60.96 13.72,60.96 v12.95,60.2 | DART.36 73.15,44.96 61.47,44.96 v61.21,45.21 | v60.96,55.63 60.71,55.37 49.78,55.37 49.53,55.12 21.84,55.12 v21.59,55.37
M1  (via drill 0.5)
  Top 0.254: v53.85,36.32 53.85,30.99 54.1,30.73 54.1,19.56 v53.59,19.05
  Bottom 0.254: JP1.28 8.13,22.86 9.4,21.59 10.67,21.59 11.94,20.32 IC1.27 26.16,20.32 27.43,19.05 v53.59,19.05 | DART.8 58.17,35.56 56.9,36.83 54.36,36.83 v53.85,36.32
MREQ  (via drill 0.5)
  Top 0.254: v12.19,60.96 11.94,60.71 11.94,43.94 11.43,43.43 11.43,8.38 10.67,7.62 IC1.19
  Bottom 0.254: JP1.37 3.81,8.89 8.13,8.89 9.4,7.62 IC1.19 | IC3.2 17.27,61.47 12.7,61.47 v12.19,60.96
N$1
  Bottom 0.254: C7.1 IC5.1
N$2
  Bottom 0.254: C8.1 IC5.4
N$3
  Bottom 0.254: C8.2 47.28,74.08 47.62,74.42 47.62,77.47 IC5.5
N$4
  Bottom 0.254: C7.2 39.66,74.08 40.01,74.42 40.01,79.25 40.77,80.01 43.31,80.01 43.81,79.5 IC5.3
N$5
  Bottom 0.254: IC5.2 42.55,77.47 C9.1
N$6
  Bottom 0.254: C10.1 50.16,77.98 50.93,78.74 IC5.6
N$7
  Bottom 0.254: C2.1 IC4.1
N$8
  Bottom 0.254: IC4.4 C3.1
N$9
  Bottom 0.254: C2.2 14.9,74.08 15.24,74.42 15.24,79.5 15.75,80.01 18.54,80.01 19.05,79.5 IC4.3
N$10
  Bottom 0.254: C3.2 22.52,74.08 22.86,74.42 22.86,77.47 IC4.5
N$11
  Bottom 0.254: IC4.2 17.78,77.47 C4.1
N$12
  Bottom 0.254: C5.1 25.4,78.23 25.91,78.74 IC4.6
N$13
  Bottom 0.254: X1.4 55.68,94.79 56.39,95.5 61.98,95.5 62.48,95 62.48,94.03 X1.6
N$14
  Bottom 0.254: X2.4 18.85,94.54 19.56,95.25 25.15,95.25 25.7,94.69 X2.6
NMI
  Bottom 0.254: JP1.33 3.81,13.97 8.13,13.97 9.4,12.7 IC1.17 10.67,12.7 11.94,11.43 R2.1
PA0  (via drill 0.5)
  Top 0.254: U$1.4 81.03,48.01 81.03,54.36 80.26,55.12 80.26,63.25 v80.52,63.5
  Bottom 0.254: v80.52,63.5 J1.P$13
PA1  (via drill 0.5)
  Top 0.254: U$1.3 80.52,50.04 80.52,54.1 79.76,54.86 79.76,65.79 v80.01,66.04
  Bottom 0.254: v80.01,66.04 J1.P$12
PA2  (via drill 0.5)
  Top 0.254: U$1.2 80.01,52.07 80.01,53.85 79.25,54.61 79.25,68.33 v79.5,68.58
  Bottom 0.254: v79.5,68.58 J1.P$11
PA3  (via drill 0.5)
  Top 0.254: U$1.1 78.74,70.87 v78.99,71.12
  Bottom 0.254: v78.99,71.12 J1.P$10
PA4  (via drill 0.5)
  Top 0.254: v76.2,55.63 76.2,65.79 75.44,66.55 75.44,73.41 v75.69,73.66
  Bottom 0.254: U$1.40 93.98,54.61 93.22,55.37 76.45,55.37 v76.2,55.63 | v75.69,73.66 J1.P$9
PA5  (via drill 0.5)
  Top 0.254: v75.44,56.64 75.69,56.9 75.69,65.53 74.93,66.29 74.93,75.44 v75.69,76.2
  Bottom 0.254: U$1.39 95,51.82 95,54.61 93.73,55.88 77.22,55.88 76.71,56.39 75.69,56.39 v75.44,56.64 | v75.69,76.2 J1.P$8
PA6  (via drill 0.5)
  Top 0.254: v74.68,57.66 74.68,65.53 74.17,66.04 74.17,77.22 v75.69,78.74
  Bottom 0.254: U$1.38 95.5,49.78 95.5,55.12 94.23,56.39 77.47,56.39 76.45,57.4 74.93,57.4 v74.68,57.66 | v75.69,78.74 J1.P$7
PA7  (via drill 0.5)
  Top 0.254: v69.09,58.67 v69.09,78.23
  Bottom 0.254: U$1.37 96.01,47.75 96.01,55.37 94.49,56.9 77.72,56.9 76.2,58.42 69.34,58.42 v69.09,58.67 | v69.09,78.23 72.14,81.28 J1.P$6
PB0  (via drill 0.5)
  Top 0.254: U$1.18 84.07,15.49 84.07,44.2 85.6,45.72 85.6,56.64 84.84,57.4 84.84,60.71 85.85,61.72 85.85,67.56 84.84,68.58 84.84,70.36 84.33,70.87 84.33,83.57 v84.07,83.82
  Bottom 0.254: v84.07,83.82 J1.P$5
PB1  (via drill 0.5)
  Top 0.254: U$1.19 84.58,13.46 84.58,43.94 86.11,45.47 86.11,56.9 85.34,57.66 85.34,60.45 86.36,61.47 86.36,69.6 84.84,71.12 84.84,86.11 v85.09,86.36
  Bottom 0.254: v85.09,86.36 J1.P$4
PB2  (via drill 0.5)
  Top 0.254: U$1.20 85.09,11.43 85.09,43.69 86.61,45.21 86.61,57.15 85.85,57.91 85.85,60.2 86.87,61.21 86.87,69.85 85.34,71.37 85.34,85.6 85.85,86.11 85.85,88.65 v86.11,88.9
  Bottom 0.254: v86.11,88.9 J1.P$3
PB3  (via drill 0.5)
  Top 0.254: U$1.21 85.6,13.46 85.6,43.43 87.12,44.96 87.12,57.4 86.36,58.17 86.36,59.94 87.38,60.96 87.38,70.1 85.85,71.63 85.85,85.34 86.87,86.36 86.87,91.19 v87.12,91.44
  Bottom 0.254: v87.12,91.44 J1.P$2
PB4  (via drill 0.5)
  Top 0.254: U$1.22 86.11,15.49 86.11,43.18 87.63,44.7 87.63,57.66 86.87,58.42 86.87,59.69 87.88,60.71 87.88,92.46 v88.14,92.71
  Bottom 0.254: v88.14,92.71 91.44,92.71 91.95,92.2 J1.P$25
PB5  (via drill 0.5)
  Top 0.254: U$1.23 86.61,17.53 86.61,42.93 88.14,44.45 88.14,60.2 88.39,60.45 88.39,89.92 v88.65,90.17
  Bottom 0.254: v88.65,90.17 91.44,90.17 91.95,89.66 J1.P$24
PB6
  Top 0.254: U$1.24 87.12,19.56 87.12,42.67 88.9,44.45 88.9,61.21 90.42,62.74 90.42,84.84 J1.P$23
PB7
  Top 0.254: U$1.25 87.63,21.59 87.63,42.42 89.41,44.2 89.41,60.96 90.93,62.48 90.93,82.8 J1.P$22
PC0  (via drill 0.5)
  Top 0.254: U$1.14 82.04,23.62 82.04,45.21 83.57,46.74 83.57,55.63 82.8,56.39 82.8,61.72 83.31,62.23 83.31,64.52 v83.57,64.77
  Bottom 0.254: v83.57,64.77 91.44,64.77 91.95,64.26 J1.P$14
PC1  (via drill 0.5)
  Top 0.254: U$1.15 82.55,21.59 82.55,44.96 84.07,46.48 84.07,55.88 83.31,56.64 83.31,61.47 84.33,62.48 84.33,65.28 83.31,66.29 83.31,67.06 v83.57,67.31
  Bottom 0.254: v83.57,67.31 91.44,67.31 91.95,66.8 J1.P$15
PC2  (via drill 0.5)
  Top 0.254: U$1.16 83.06,19.56 83.06,44.7 84.58,46.23 84.58,56.13 83.82,56.9 83.82,61.21 84.84,62.23 84.84,67.06 83.31,68.58 83.31,69.6 v83.57,69.85
  Bottom 0.254: v83.57,69.85 91.44,69.85 91.95,69.34 J1.P$16
PC3  (via drill 0.5)
  Top 0.254: U$1.17 83.57,17.53 83.57,44.45 85.09,45.97 85.09,56.39 84.33,57.15 84.33,60.96 85.34,61.98 85.34,67.31 84.33,68.33 84.33,70.1 83.31,71.12 83.31,72.14 v83.57,72.39
  Bottom 0.254: v83.57,72.39 91.44,72.39 91.95,71.88 J1.P$17
PC4  (via drill 0.5)
  Top 0.254: U$1.13 81.53,25.65 81.53,45.47 83.06,46.99 83.06,55.37 82.3,56.13 82.3,61.98 82.8,62.48 82.8,74.68 v83.06,74.93
  Bottom 0.254: v83.06,74.93 91.44,74.93 91.95,74.42 J1.P$18
PC5  (via drill 0.5)
  Top 0.254: U$1.12 81.03,27.69 81.03,45.72 82.55,47.24 82.55,55.12 81.79,55.88 81.79,62.23 82.3,62.74 82.3,77.22 v82.55,77.47
  Bottom 0.254: v82.55,77.47 91.44,77.47 91.95,76.96 J1.P$19
PC6  (via drill 0.5)
  Top 0.254: U$1.11 80.52,29.72 80.52,45.97 82.04,47.5 82.04,54.86 81.28,55.63 81.28,62.48 81.79,62.99 81.79,79.76 v82.04,80.01
  Bottom 0.254: v82.04,80.01 91.44,80.01 91.95,79.5 J1.P$20
PC7  (via drill 0.5)
  Top 0.254: U$1.10 80.01,31.75 80.01,46.23 81.53,47.75 81.53,54.61 80.77,55.37 80.77,62.74 81.28,63.25 81.28,82.3 v81.53,82.55
  Bottom 0.254: v81.53,82.55 91.44,82.55 91.95,82.04 J1.P$21
PIOCE  (via drill 0.5)
  Top 0.254: IC3.20 26.67,68.33 v26.92,68.07 | U$1.6 77.72,40.64 77.47,40.89 77.47,67.56 v77.22,67.82
  Bottom 0.254: v26.92,68.07 76.96,68.07 v77.22,67.82
RAMCE  (via drill 0.5)
  Top 0.254: IC3.22 21.59,66.8 v21.84,66.55 | v46.99,66.29 46.99,34.8 v47.5,34.29
  Bottom 0.254: v21.84,66.55 46.74,66.55 v46.99,66.29 | v47.5,34.29 54.1,34.29 55.37,33.02 U1.P$20
RD  (via drill 0.5)
  Top 0.254: v13.21,59.18 12.95,58.93 12.95,43.43 12.45,42.93 v12.45,5.08 | v31.24,38.86 30.99,38.61 30.99,35.31 32.26,34.04 32.26,20.83 26.67,15.24 26.67,6.35 IC1.21 | U1.P$22 56.13,38.35 57.66,38.35 57.91,38.1 57.91,37.34 57.66,37.08 57.66,34.54 v57.91,34.29 | DART.32 75.18,33.02 75.69,32.51 76.45,32.51 76.96,33.02 76.96,33.53 76.45,34.04 76.45,38.1 76.2,38.35 v76.2,42.42
  Bottom 0.254: JP1.40 8.13,7.62 9.4,6.35 10.67,6.35 11.94,5.08 v12.45,5.08 IC1.21 | U1.P$22 50.29,38.1 49.02,39.37 47.5,39.37 46.23,38.1 28C256.P$22 42.42,38.1 41.15,39.37 31.75,39.37 v31.24,38.86 | IC3.4 21.34,60.45 14.48,60.45 v13.21,59.18 | v57.91,34.29 73.66,34.29 DART.32 | v76.2,42.42 76.2,42.67 76.71,43.18 U$1.5
RESET  (via drill 0.5)
  Top 0.254: v61.21,43.18 63.25,45.21 63.25,58.17 v62.23,59.18 | v43.18,59.44 43.18,63.75 41.91,65.02 IC3.14
  Bottom 0.254: U$1.35 80.52,40.64 79.25,41.91 76.71,41.91 76.45,41.66 75.95,41.66 75.69,41.91 62.48,41.91 v61.21,43.18 | v62.23,59.18 43.43,59.18 v43.18,59.44
RFSH
  Bottom 0.254: JP1.26 8.13,25.4 9.4,24.13 10.67,24.13 11.94,22.86 IC1.28
ROMCE  (via drill 0.5)
  Top 0.254: IC3.23 19.05,66.29 21.08,64.26 27.18,64.26 27.94,63.5 27.94,56.39 30.23,54.1 30.23,40.89 32,39.12 32,35.31 v33.02,34.29
  Bottom 0.254: v33.02,34.29 41.15,34.29 42.42,33.02 28C256.P$20
RTSA  (via drill 0.5)
  Top 0.254: v69.6,13.21 69.6,18.54 69.85,18.8 69.85,26.42 70.36,26.92 70.36,79.5 v69.34,80.52
  Bottom 0.254: DART.17 69.09,12.7 v69.6,13.21 | v69.34,80.52 68.33,81.53 31.5,81.53 IC4.11
RTSA_232
  Bottom 0.254: IC4.14 19.05,86.11 19.81,85.34 22.1,85.34 22.86,86.11 22.86,93.88 X2.7
RTSB  (via drill 0.5)
  Top 0.254: v72.39,13.21 72.39,84.07 v71.88,84.58
  Bottom 0.254: DART.24 72.9,12.7 v72.39,13.21 | v71.88,84.58 71.63,84.84 52.96,84.84 IC5.11
RTSB_232  (via drill 0.5)
  Top 0.254: X1.7 59.79,89.26 v59.44,88.9
  Bottom 0.254: v59.44,88.9 46.35,88.9 IC5.14
RXA  (via drill 0.5)
  Top 0.254: v71.12,25.91 71.37,26.16 71.37,81.53 v70.87,82.04
  Bottom 0.254: DART.12 70.61,25.4 v71.12,25.91 | v70.87,82.04 70.36,82.55 34.04,82.55 31.75,84.84 IC4.9
RXA_232
  Top 0.254: IC4.8 31.75,79.5 25.4,85.85 25.4,86.87 24.33,87.94 X2.2
RXB  (via drill 0.5)
  Top 0.254: DART.28 73.66,24.13 73.66,85.72 v73.03,86.36
  Bottom 0.254: v73.03,86.36 IC5.9
RXB_232
  Top 0.254: X1.2 61.16,84.78 56.52,80.14 IC5.8
TXA  (via drill 0.5)
  Top 0.254: v70.36,18.29 70.36,26.16 70.87,26.67 70.87,80.52 v70.1,81.28
  Bottom 0.254: DART.15 69.85,17.78 v70.36,18.29 | v70.1,81.28 69.34,82.04 33.53,82.04 IC4.10
TXA_232
  Top 0.254: IC4.7 29.21,79.5 22.86,85.85 22.86,86.87 21.59,88.14 X2.3
TXB  (via drill 0.5)
  Top 0.254: DART.26 73.15,19.56 73.15,84.84 v72.64,85.34
  Bottom 0.254: v72.64,85.34 54.99,85.34 IC5.10
TXB_232
  Top 0.254: IC5.7 53.98,79.38 58.42,83.82 X1.3
VCC  (via drill 0.5)
  Top 0.254: v18.29,13.97 v18.29,16.51 v18.29,19.05 v18.29,26.16 18.29,30.48 v22.1,34.29 | v18.29,13.97 v18.29,11.43 | v24.64,13.97 v18.29,13.97 | v64.01,56.39 64.52,55.88 64.52,41.4 v64.52,40.64 v64.52,33.53 v64.52,22.1 v64.52,14.22 | U1.P$28 v55.88,56.9 v47.75,56.9 | v45.97,56.9 44.45,55.37 28C256.P$28 42.42,53.34 40.64,55.12 v40.64,73.15 | v33.78,86.36 33.78,77.72 33.02,76.96 11.94,76.96 J2.5V | v44.96,79.76 38.86,85.85 38.86,86.23 IC5.16
  Bottom 0.254: JP1.21 3.81,29.21 8.13,29.21 9.4,27.94 IC1.11 10.67,27.94 12.45,26.16 v18.29,26.16 | U1.P$28 50.29,53.34 49.02,54.61 47.5,54.61 46.23,53.34 28C256.P$28 | R5.2 v18.29,19.05 | v18.29,11.43 R2.2 | v18.29,16.51 R4.2 | R3.2 v18.29,13.97 R1.2 | 1.8432MHZ.8 53.34,13.72 | 53.34,13.72 52.58,14.48 38.1,14.48 | 38.1,14.48 27.94,14.48 27.43,13.97 v24.64,13.97 | CPU-CLOCK.8 38.1,14.48 | U$1.26 90.68,17.78 89.79,18.67 C15.1 80.56,22.64 79.5,21.59 65.02,21.59 v64.52,22.1 | C14.1 64.52,32.89 | 64.52,32.89 59.82,32.89 DART.9 | v64.52,33.53 64.52,32.89 | v64.01,56.39 63.5,56.9 v55.88,56.9 C13.1 | v45.97,56.9 C12.1 v47.75,56.9 | C16.1 16.17,71.21 16.26,71.12 | C1.1 13.63,86.7 IC4.16 | C4.2 17.78,72.14 IC3.24 | v33.78,86.36 33.87,86.45 C6.1 36.28,86.36 IC5.16 41.78,83.31 70.36,83.31 70.87,82.8 71.37,82.8 73.66,85.09 92.46,85.09 92.96,85.6 92.96,93.47 92.46,93.98 J1.P$26 | v44.96,79.76 44.96,75.44 43.6,74.08 C9.2 41.57,74.08 v40.64,73.15 | v22.1,34.29 C11.1 | 53.34,13.72 64.01,13.72 v64.52,14.22 | R6.2 68.26,41.21 68.07,41.4 65.28,41.4 v64.52,40.64
  Bottom 0.406: C1.1 8.22,86.7 6.35,84.84 J2.5V 10.41,78.49 10.41,71.88 11.18,71.12 16.26,71.12 IC3.24
WAIT
  Bottom 0.254: JP1.34 8.13,15.24 9.4,13.97 10.67,13.97 11.94,12.7 22.61,12.7 | 22.61,12.7 IC1.24 | R3.1 22.54,12.77 22.61,12.7
WR  (via drill 0.5)
  Top 0.254: v13.72,58.17 13.46,57.91 13.46,43.18 12.95,42.67 12.95,7.87 v13.21,7.62 | v27.94,52.07 27.69,52.07 26.67,53.09 IC3.5 | U1.P$27 57.15,52.07 57.15,55.37 v57.91,56.13 | v62.48,56.13 62.23,55.88 62.23,47.24 v62.48,46.99
  Bottom 0.254: JP1.38 8.13,10.16 9.4,8.89 10.67,8.89 11.94,7.62 v13.21,7.62 IC1.22 | U1.P$27 50.29,50.8 49.02,52.07 47.5,52.07 46.23,50.8 28C256.P$27 42.42,50.8 41.15,52.07 v27.94,52.07 | IC3.5 23.37,59.94 15.49,59.94 v13.72,58.17 | U$1.36 92.71,44.45 78.23,44.45 75.69,46.99 v62.48,46.99 | v57.91,56.13 58.17,56.39 62.23,56.39 v62.48,56.13

### Text on the board
tPlace: GND | VCC | PB3 | PB4 | PORTA | PORTB | PB2 | PB5 | PB1 | PB6 | PB0 | PB7 | PA7 | PC7 | +5v | PA6 | PC6 | PA5 | PC5 | PA4 | PC4 | GND | G80-S Micro v1.0 | PA3 | PC3 | By Doug Gabbard - 2017 | PA2 | PC2 | GAL22V10 | PA1 | PC1 | NC | PA0 | PC0 | Z80 / PINS | www.retrodepot.net